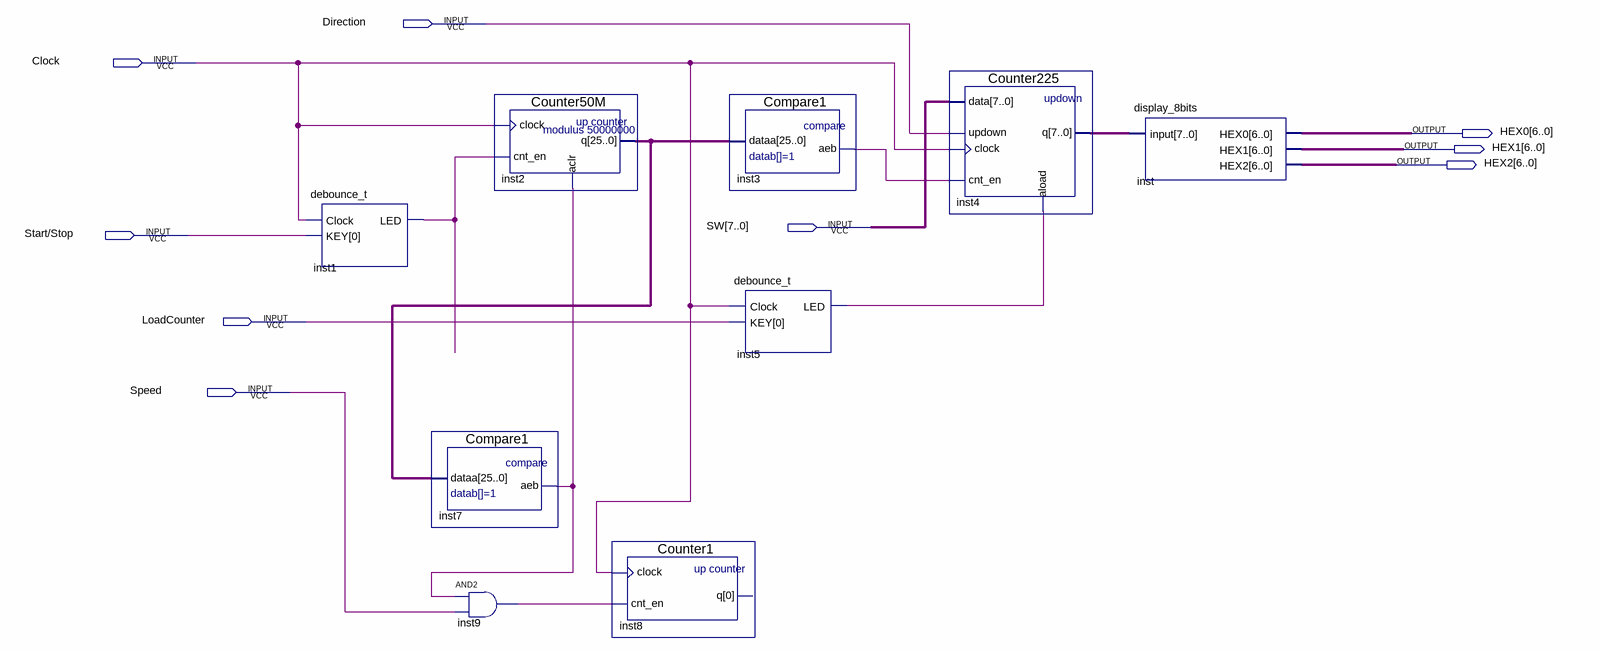
[diagram p0: schematic sheet]
// Quartus schematic counter_8bits (2022_05_22 18_19_10 UTC).bdf as structural Verilog: 9 symbols, 9 pins
module \counter_8bits_(2022_05_22_18_19_10_UTC)  (
  input  Direction,
  input  Clock,
  input  [7:0] SW,
  input  \Start/Stop ,
  input  LoadCounter,
  input  Speed,
  output [6:0] HEX0,
  output [6:0] HEX1,
  output [6:0] HEX2
);

  wire inst1_led, inst3_aeb, inst5_led, inst7_aeb, inst9_out;
  wire [7:0] inst4_q;
  wire [25:0] inst2_q;

  debounce_t inst1 (.Clock(Clock), .KEY(\Start/Stop ), .LED(inst1_led));
  Compare1 inst7 (.dataa(inst2_q), .aeb(inst7_aeb));
  and inst9 (inst9_out, inst7_aeb, Speed);
  Counter50M inst2 (.clock(Clock), .cnt_en(inst1_led), .aclr(inst7_aeb), .q(inst2_q));
  Counter1 inst8 (.clock(Clock), .cnt_en(inst9_out));  // open: q
  Compare1 inst3 (.dataa(inst2_q), .aeb(inst3_aeb));
  debounce_t inst5 (.Clock(Clock), .KEY(LoadCounter), .LED(inst5_led));
  Counter225 inst4 (.data(SW), .updown(Direction), .clock(Clock), .cnt_en(inst3_aeb), .aload(inst5_led), .q(inst4_q));
  display_8bits inst (.\input (inst4_q), .HEX0(HEX0), .HEX1(HEX1), .HEX2(HEX2));
endmodule
